# EAGLE design LOFM (EAGLE 6.5.0)
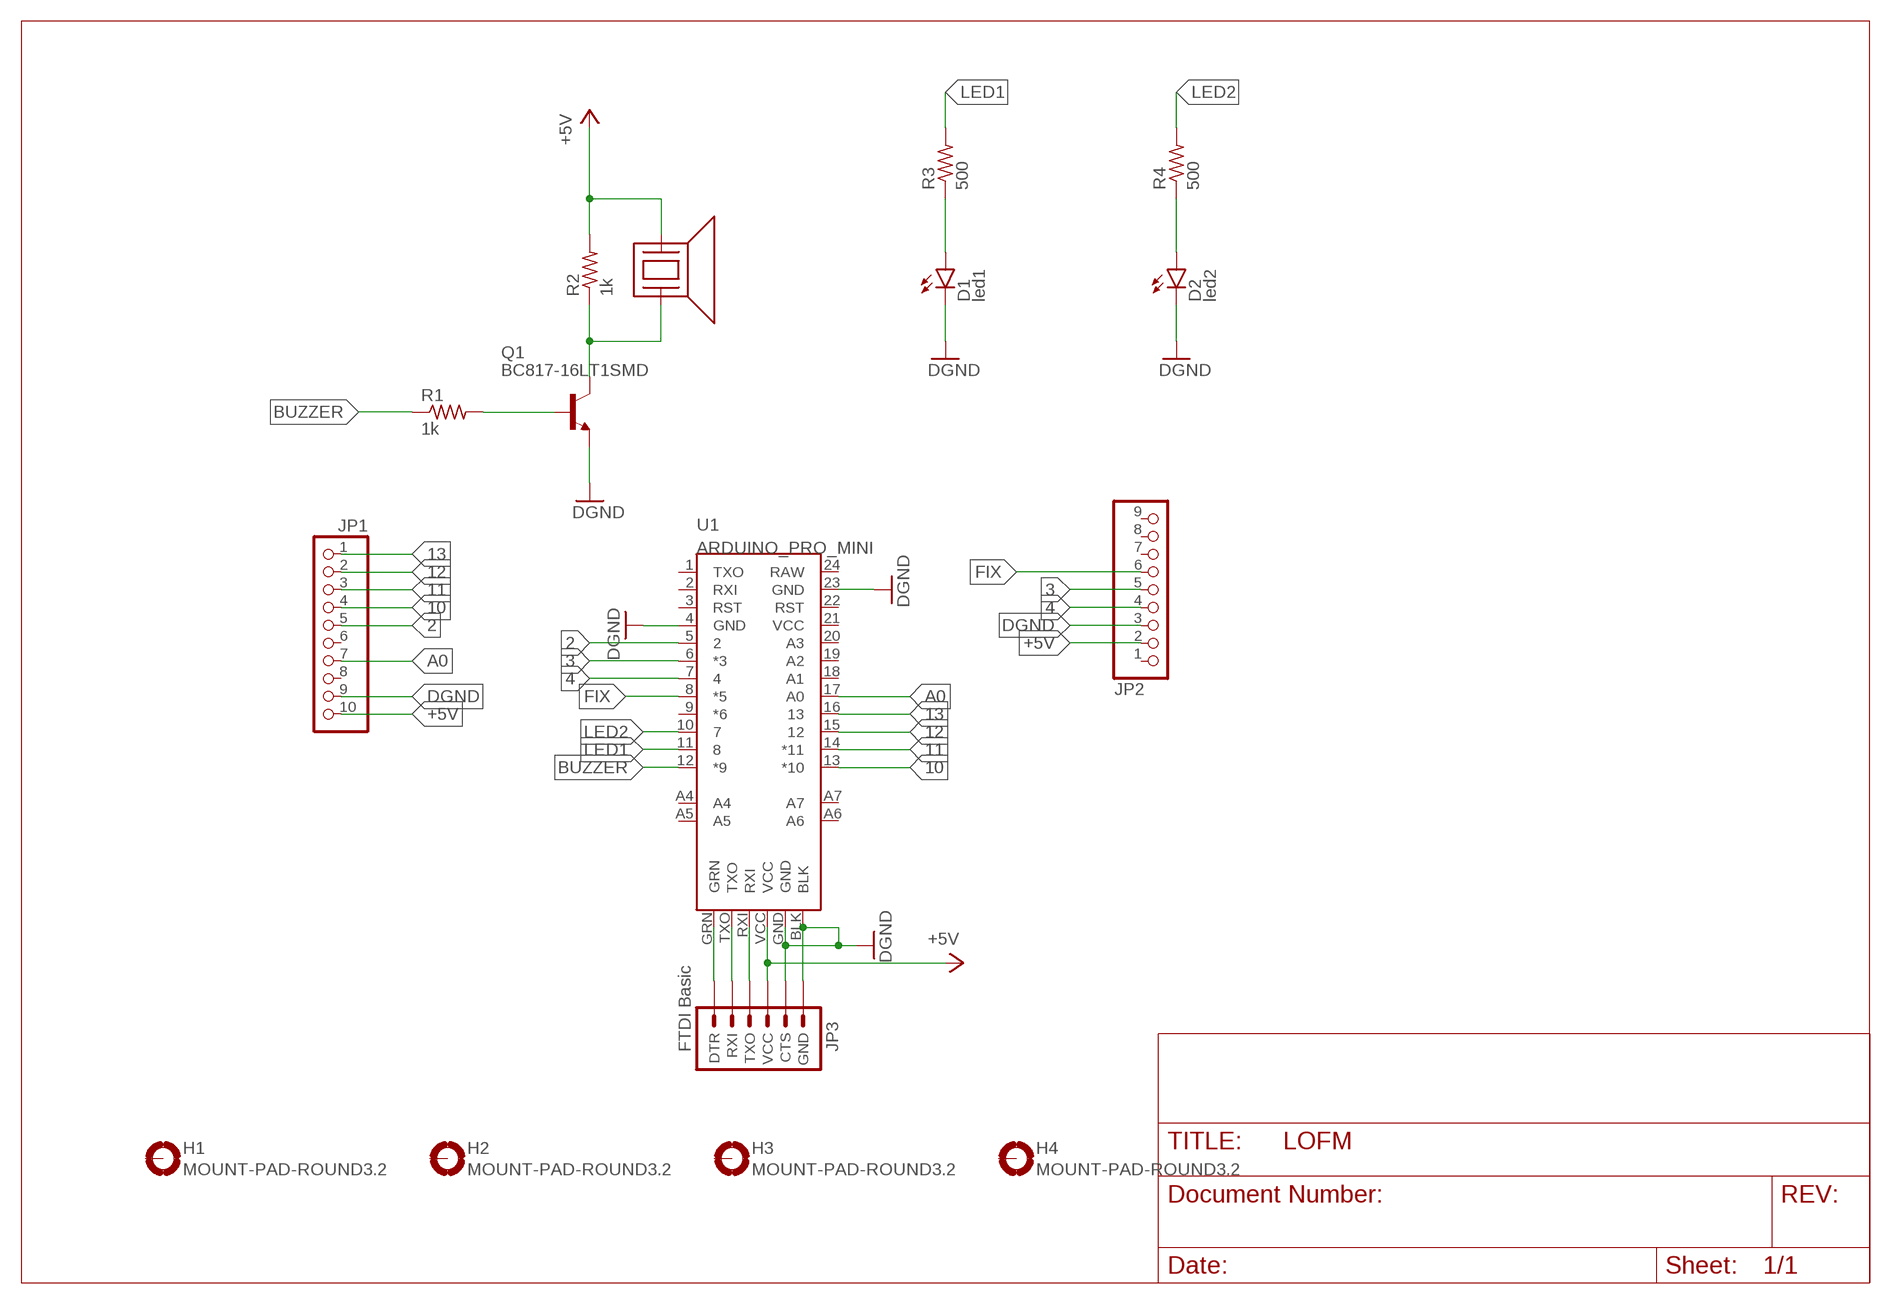
[diagram p0: schematic, sheet 1]

## Parts
D1  led1  LED3MM  [LED3MM]
D2  led2  LED3MM  [LED3MM]
H1  MOUNT-PAD-ROUND3.2  [3,2-PAD]
H2  MOUNT-PAD-ROUND3.2  [3,2-PAD]
H3  MOUNT-PAD-ROUND3.2  [3,2-PAD]
H4  MOUNT-PAD-ROUND3.2  [3,2-PAD]
JP1  HEADER-1X1070MIL  [1X10_ROUND70]
JP2  HEADER-1X970MIL  [1X09_ROUND_70]
JP3  FTDI Basic  ARDUINO_SERIAL_PROGRAMPTH  [1X06]
Q1  BC817-16LT1SMD  [SOT23-BEC]
R1  1k  R0603(1608)  [R0603(1608)]
R2  1k  R0603(1608)  [R0603(1608)]
R3  500  R0603(1608)  [R0603(1608)]
R4  500  R0603(1608)  [R0603(1608)]
U1  ARDUINO_PRO_MINI  [ARDUINO_PRO_MINI]
U7  BUZZER  [PS1240]

## Nets
2: JP1.5 U1.5
3: JP2.5 U1.6(*3)
4: JP2.4 U1.7
10: JP1.4 U1.13(*10)
11: JP1.3 U1.14(*11)
12: JP1.2 U1.15
13: JP1.1 U1.16
+5V: JP1.10 JP2.2 JP3.4(VCC) R2.2 U1.VCC U7.1
A0: JP1.7 U1.17(A0)
BUZZER: R1.1 U1.12(*9)
DGND: D1.K(C) D2.K(C) JP1.9 JP2.3 JP3.5(CTS) JP3.6(GND) Q1.E U1.4(GND) U1.23(GND) U1.BLK U1.GND
FIX: JP2.6 U1.8(*5)
LED1: R3.2 U1.11
LED2: R4.2 U1.10
N$1: Q1.B R1.2
N$2: Q1.C R2.1 U7.2
N$4: D1.A R3.1
N$5: D2.A R4.1
N$7: JP3.3(TXO) U1.RXI
N$8: JP3.2(RXI) U1.TXO
N$9: JP3.1(DTR) U1.GRN
Unconnected: H1.B3,2(MOUNT) H2.B3,2(MOUNT) H3.B3,2(MOUNT) H4.B3,2(MOUNT) JP1.6 JP1.8 JP2.1 JP2.7 JP2.8 JP2.9 U1.1(TXO) U1.2(RXI) U1.3(RST) U1.9(*6) U1.18(A1) U1.19(A2) U1.20(A3) U1.21(VCC) U1.22(RST) U1.24(RAW) U1.A4 U1.A5 U1.A6 U1.A7

## Library data of the parts
D1 D2 = SparkFun-LED:LED: LEDs Standard schematic elements and footprints for 5mm, 3mm, 1206, and 0603 sized LEDs. 5mm - Spark Fun Electronics SKU : COM-00529 (and others)
H1-H4 = berry:MOUNT-PAD-ROUND: MOUNTING PAD, round
JP1 = microbuilder:HEADER-1X10: PIN HEADER
JP2 = microbuilder:HEADER-1X9: PIN HEADER
JP3 = SparkFun:ARDUINO_SERIAL_PROGRAM
Q1 = berry:BC817*: NPN Transistor
R1-R4 = berry:R
U1 = LOFM:ARDUINO_PRO_MINI
U7 = berry:BUZZER

## Board
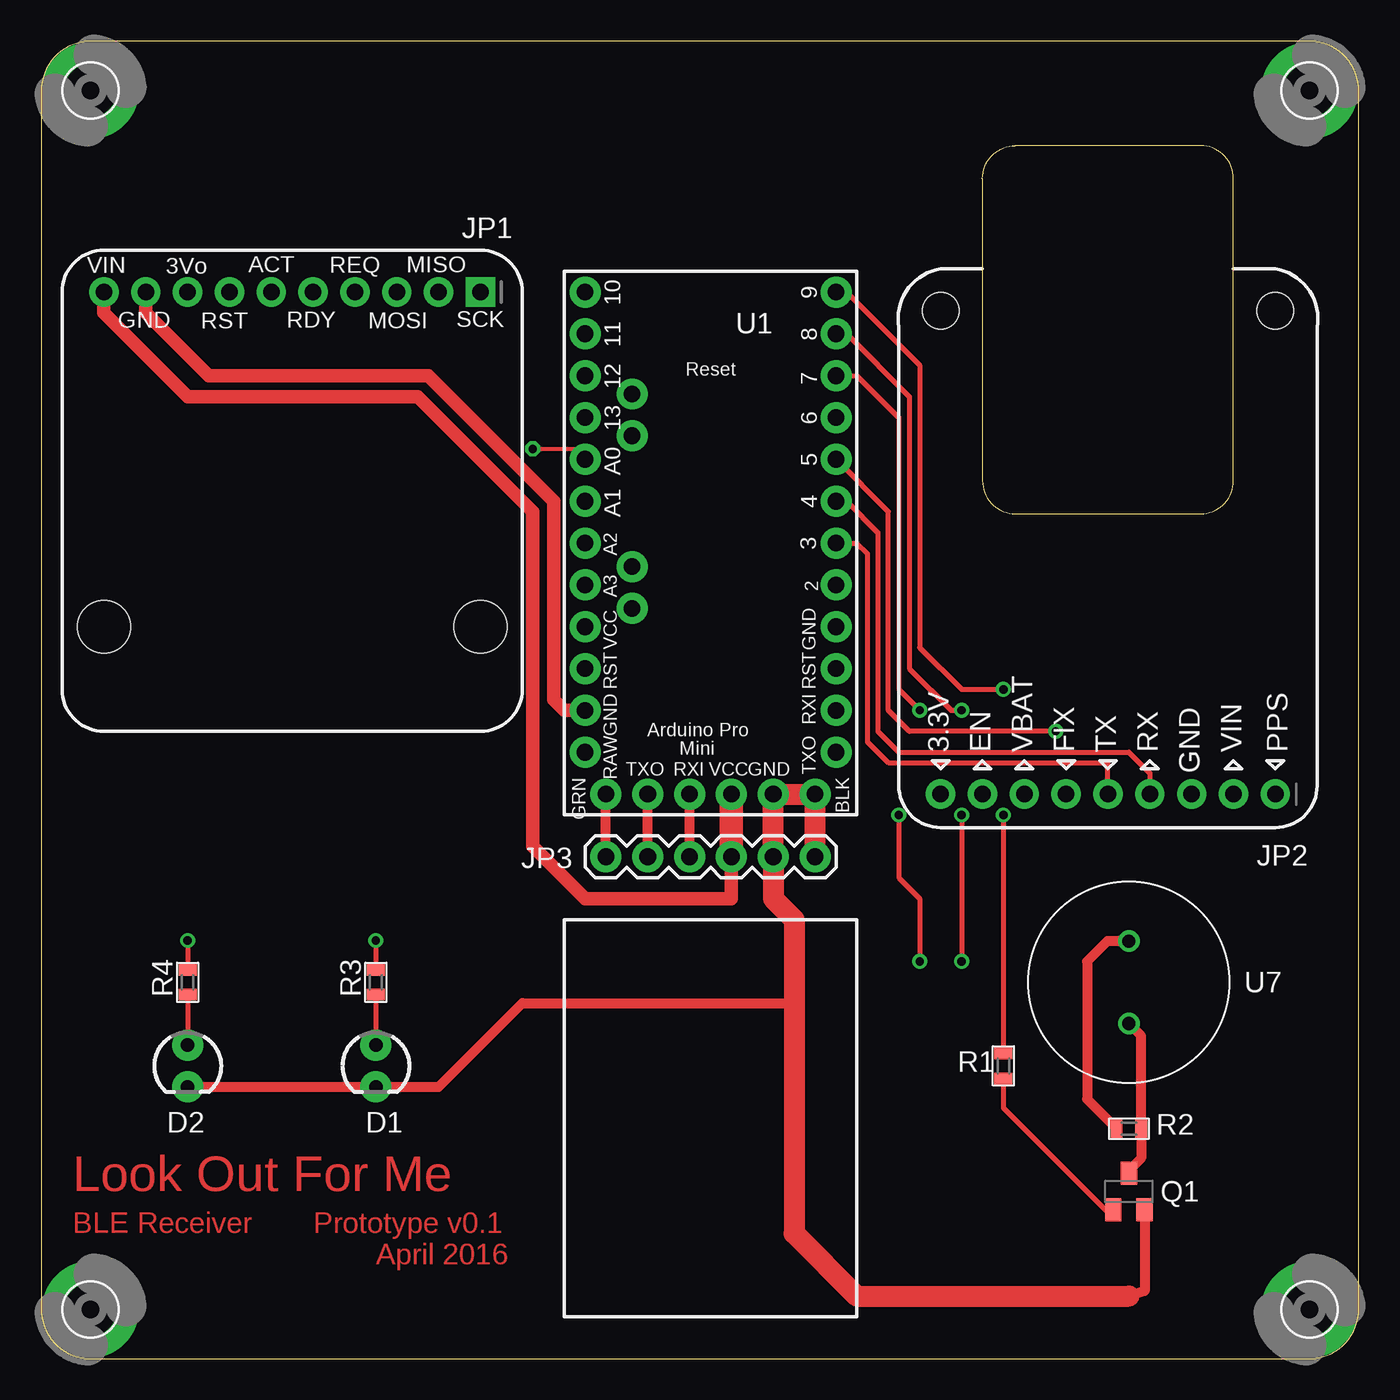
[diagram p1: board, top side]
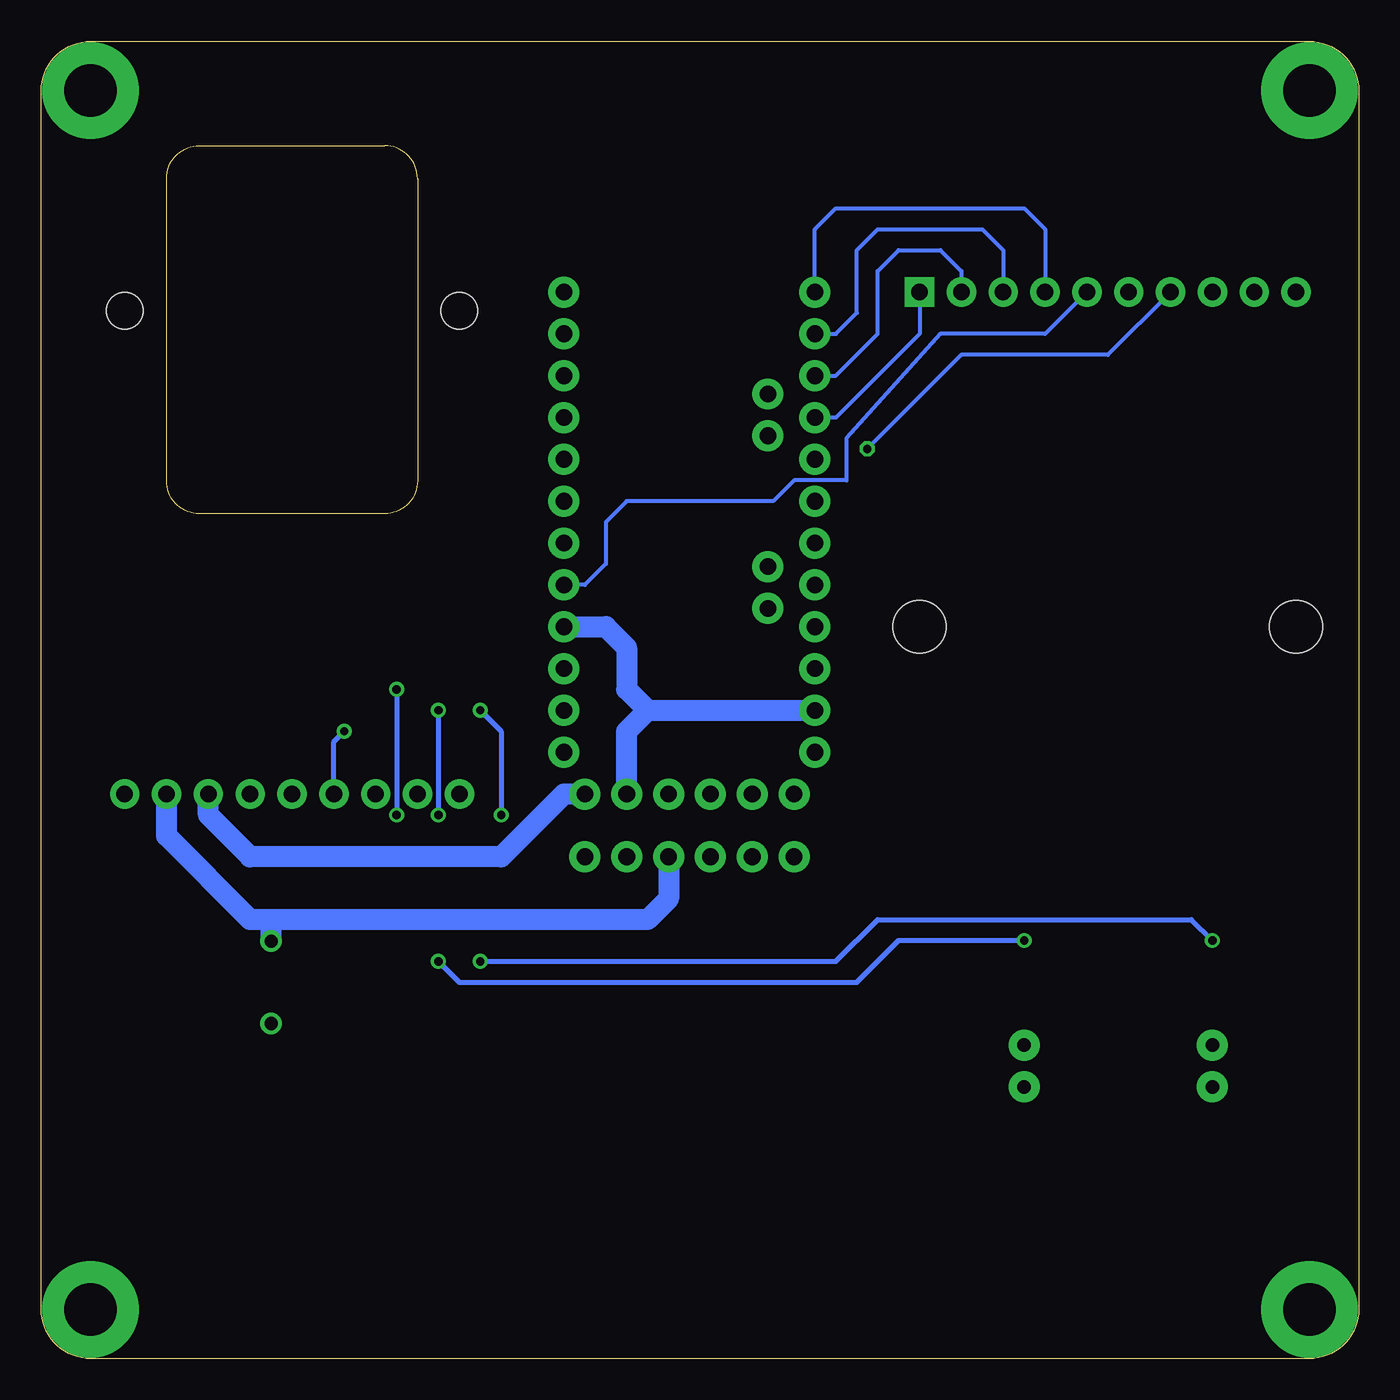
[diagram p2: board, bottom side, seen from below]

Size 80 x 80 mm. Coordinates in mm from the lower left corner, seen from the top.
Outline: 0,77 0,3 arc90 3,0 77,0 arc90 80,3 80,77 arc90 77,80 3,80 arc90 0,77
Outline: 57.15,71.66 57.15,53.31 arc90 59.15,51.31 70.39,51.31 arc90 72.39,53.31 72.39,71.66 arc90 70.39,73.66 59.15,73.66 arc90 57.15,71.66
Copper layers (1*16): Top 0.035mm / dielectric 1.5mm / Bottom 0.035mm
Design rules "default": minimum track width 10mil, minimum drill 24mil, track to track 8mil, track to pad 8mil, pad to pad 8mil, via to via 8mil, smd to smd 8mil, copper to edge 40mil, drill to drill 8mil, minimum pad ring 10mil, minimum via ring 8mil, stop-mask expansion 4mil, vias tented up to drill 0mil, thermal gap 10mil
Holes 3.2 mm at 26.67,44.45 3.81,44.45
Holes 2.2 mm at 54.61,63.64 74.93,63.64

### Footprints (pad centres in the part's own frame; a part is rotated, then mirrored left to right if it is on the bottom)
LED3MM = drill 0.813 pad 1.88: A -1.27,0; K 1.27,0
3,2-PAD = drill 3.2 pad 5.842: B3,2 0,0
1X10_ROUND70 = drill 1 pad 1.778 square: 1 -11.43,0 | drill 1 pad 1.778: 2 -8.89,0; 3 -6.35,0; 4 -3.81,0; 5 -1.27,0; 6 1.27,0; 7 3.81,0; 8 6.35,0; 9 8.89,0; 10 11.43,0
1X09_ROUND_70 = drill 1 pad 1.778: 1 -10.16,0; 2 -7.62,0; 3 -5.08,0; 4 -2.54,0; 5 0,0; 6 2.54,0; 7 5.08,0; 8 7.62,0; 9 10.16,0
1X06 = drill 1.016 pad 1.88: 1 0,0; 2 2.54,0; 3 5.08,0; 4 7.62,0; 5 10.16,0; 6 12.7,0
SOT23-BEC = smd 1 x 1.4: B -0.95,-1.1; C 0,1.1; E 0.95,-1.1
R0603(1608) = smd 0.7 x 1.1: 1 -0.75,0; 2 0.75,0
ARDUINO_PRO_MINI = drill 1.016 pad 1.88: 1 -7.62,12.7; 2 -7.62,10.16; 3 -7.62,7.62; 4 -7.62,5.08; 5 -7.62,2.54; 6 -7.62,0; 7 -7.62,-2.54; 8 -7.62,-5.08; 9 -7.62,-7.62; 10 -7.62,-10.16; 11 -7.62,-12.7; 12 -7.62,-15.24; 13 7.62,-15.24; 14 7.62,-12.7; 15 7.62,-10.16; 16 7.62,-7.62; 17 7.62,-5.08; 18 7.62,-2.54; 19 7.62,0; 20 7.62,2.54; 21 7.62,5.08; 22 7.62,7.62; 23 7.62,10.16; 24 7.62,12.7; A4 4.763,1.429; A5 4.763,3.969; A6 4.763,-9.049; A7 4.763,-6.509; BLK -6.35,15.24; GND -3.81,15.24; GRN 6.35,15.24; RXI 1.27,15.24; TXO 3.81,15.24; VCC -1.27,15.24
PS1240 = drill 0.8: 1 -2.5,0; 2 2.5,0

### Placement (x,y rotation side)
D1  20.32,17.78 270 top
D2  8.89,17.78 270 top
H1  3,77 0 top
H2  3,3 0 top
H3  77,77 0 top
H4  77,3 0 top
JP1  15.24,64.77 180 top
JP2  64.77,34.29 180 top
JP3  34.29,30.48 0 top
Q1  66.04,10.16 0 top
R1  58.42,17.78 270 top
R2  66.04,13.97 180 top
R3  20.32,22.86 90 top
R4  8.89,22.86 90 top
U1  40.64,49.53 180 top
U7  66.04,22.86 270 top

### Tracks (layer width: path | path; a pad name or v marks a point on that pad's centre or on a via)
2
  Bottom 0.254: JP1.5 19.05,62.23 25.4,62.23 31.11,55.88 31.11,53.34 34.29,53.34 35.56,52.07 44.45,52.07 45.72,50.8 45.72,48.26 46.99,46.99 U1.5
3
  Top 0.305: U1.6 49.53,49.53 50.16,48.9 50.16,37.47 51.44,36.2 64.77,36.2 JP2.5
4
  Top 0.305: U1.7 48.9,52.07 50.8,50.16 50.8,38.1 52.07,36.83 66.04,36.83 67.31,35.56 JP2.4
10
  Bottom 0.254: U1.13 33.02,68.58 31.75,69.85 20.32,69.85 19.05,68.58 JP1.4
11
  Bottom 0.254: U1.14 31.75,62.23 30.48,63.5 30.48,67.31 29.21,68.58 22.86,68.58 21.59,67.31 JP1.3
12
  Bottom 0.254: U1.15 31.75,59.69 29.21,62.23 29.21,66.04 27.94,67.31 25.4,67.31 24.13,66.04 JP1.2
13
  Bottom 0.254: JP1.1 26.67,62.23 31.75,57.15 U1.16
+5V
  Top 0.61: U7.1 64.73,25.36 63.5,24.13 63.5,15.76 R2.2
  Top 0.813: JP1.10 3.81,63.5 8.89,58.42 22.86,58.42 29.84,51.44 29.84,31.11 33.02,27.94 41.91,27.94 JP3.4
  Top 1.422: JP3.4 U1.VCC
  Bottom 1.27: JP3.4 41.91,27.94 43.18,26.67 66.04,26.67 | 66.04,26.67 67.31,26.67 72.39,31.75 JP2.2 | U7.1 66.04,26.67
A0  (via drill 0.5)
  Top 0.254: v29.84,55.24 33.02,55.24 U1.17
  Bottom 0.254: JP1.7 15.24,60.96 24.13,60.96 v29.84,55.24
BUZZER  (via drill 0.5)
  Top 0.305: U1.12 48.9,64.77 53.34,60.33 53.34,43.18 55.88,40.64 v58.42,40.64 | v58.42,33.02 R1.1
  Bottom 0.305: v58.42,40.64 v58.42,33.02
DGND
  Top 0.61: Q1.E 66.99,4.13 66.04,3.81 | D2.K D1.K 24.13,16.51 29.21,21.59 45.72,21.59
  Top 0.813: JP1.9 6.35,63.5 10.16,59.69 23.5,59.69 31.11,52.07 31.11,40.01 31.75,39.37 U1.23
  Top 1.27: JP3.6 U1.BLK U1.GND JP3.5 44.45,27.94 45.72,26.67 45.72,21.59 45.72,7.62 49.53,3.81 66.04,3.81
  Bottom 1.27: U1.BLK 48.26,34.29 52.07,30.48 67.31,30.48 69.85,33.02 JP2.3 | U1.GND 44.45,38.1 43.18,39.37 | 43.18,39.37 U1.23 | U1.4 45.72,44.45 44.45,43.18 44.45,40.64 43.18,39.37
FIX  (via drill 0.5)
  Top 0.305: v61.59,38.1 52.7,38.1 51.44,39.37 51.44,51.44 U1.8
  Bottom 0.305: JP2.6 62.23,37.47 v61.59,38.1
LED1  (via drill 0.5)
  Top 0.305: U1.11 48.9,62.23 52.7,58.42 52.7,41.91 55.24,39.37 v55.88,39.37 | v55.88,33.02 v55.88,24.13 | v20.32,25.4 R3.2
  Bottom 0.305: v55.88,39.37 v55.88,33.02 | v55.88,24.13 54.61,22.86 30.48,22.86 27.94,25.4 v20.32,25.4
LED2  (via drill 0.5)
  Top 0.305: U1.10 49.53,59.69 52.07,57.15 52.07,40.64 v53.34,39.37 | v52.07,33.02 52.07,29.21 53.34,27.94 v53.34,24.13 | v8.89,25.4 R4.2
  Bottom 0.305: v53.34,39.37 52.07,38.1 v52.07,33.02 | v53.34,24.13 31.75,24.13 29.21,26.67 10.16,26.67 v8.89,25.4
N$1
  Top 0.305: R1.2 58.42,15.24 64.77,8.89 64.92,8.89 Q1.B
N$2
  Top 0.61: U7.2 66.79,19.61 R2.1 66.79,12.18 66.04,11.43 Q1.C
N$4
  Top 0.305: R3.1 D1.A
N$5
  Top 0.305: R4.1 D2.A
N$7
  Top 0.61: JP3.3 U1.RXI
N$8
  Top 0.61: JP3.2 U1.TXO
N$9
  Top 0.61: JP3.1 U1.GRN

### Text on the board
Top: Look Out For Me | BLE Receiver | Prototype v0.1 | April 2016
tPlace: VIN | 3Vo | ACT | REQ | MISO | 10 | 9 | GND | RST | RDY | MOSI | SCK | 11 | 8 | 12 | Reset | 7 | 13 | 6 | A0 | 5 | A1 | 4 | A2 | 3 | A3 | 2 | GND | VCC | RST | RST | GND | RXI | Arduino Pro | RAW | TXO | Mini | 3.3V | EN | VBAT | FIX | TX | RX | VIN | PPS | TXO | RXI | VCC | GND | GND | GRN | BLK
tStop: Look Out For Me | BLE Receiver | Prototype v0.1 | April 2016